# EAGLE design bt_schield (EAGLE 7.2.0)
CNAME: Arduino Bluetooth HC-05 shield; CREVISION: 001; DESIGNER: M.Vagovszky
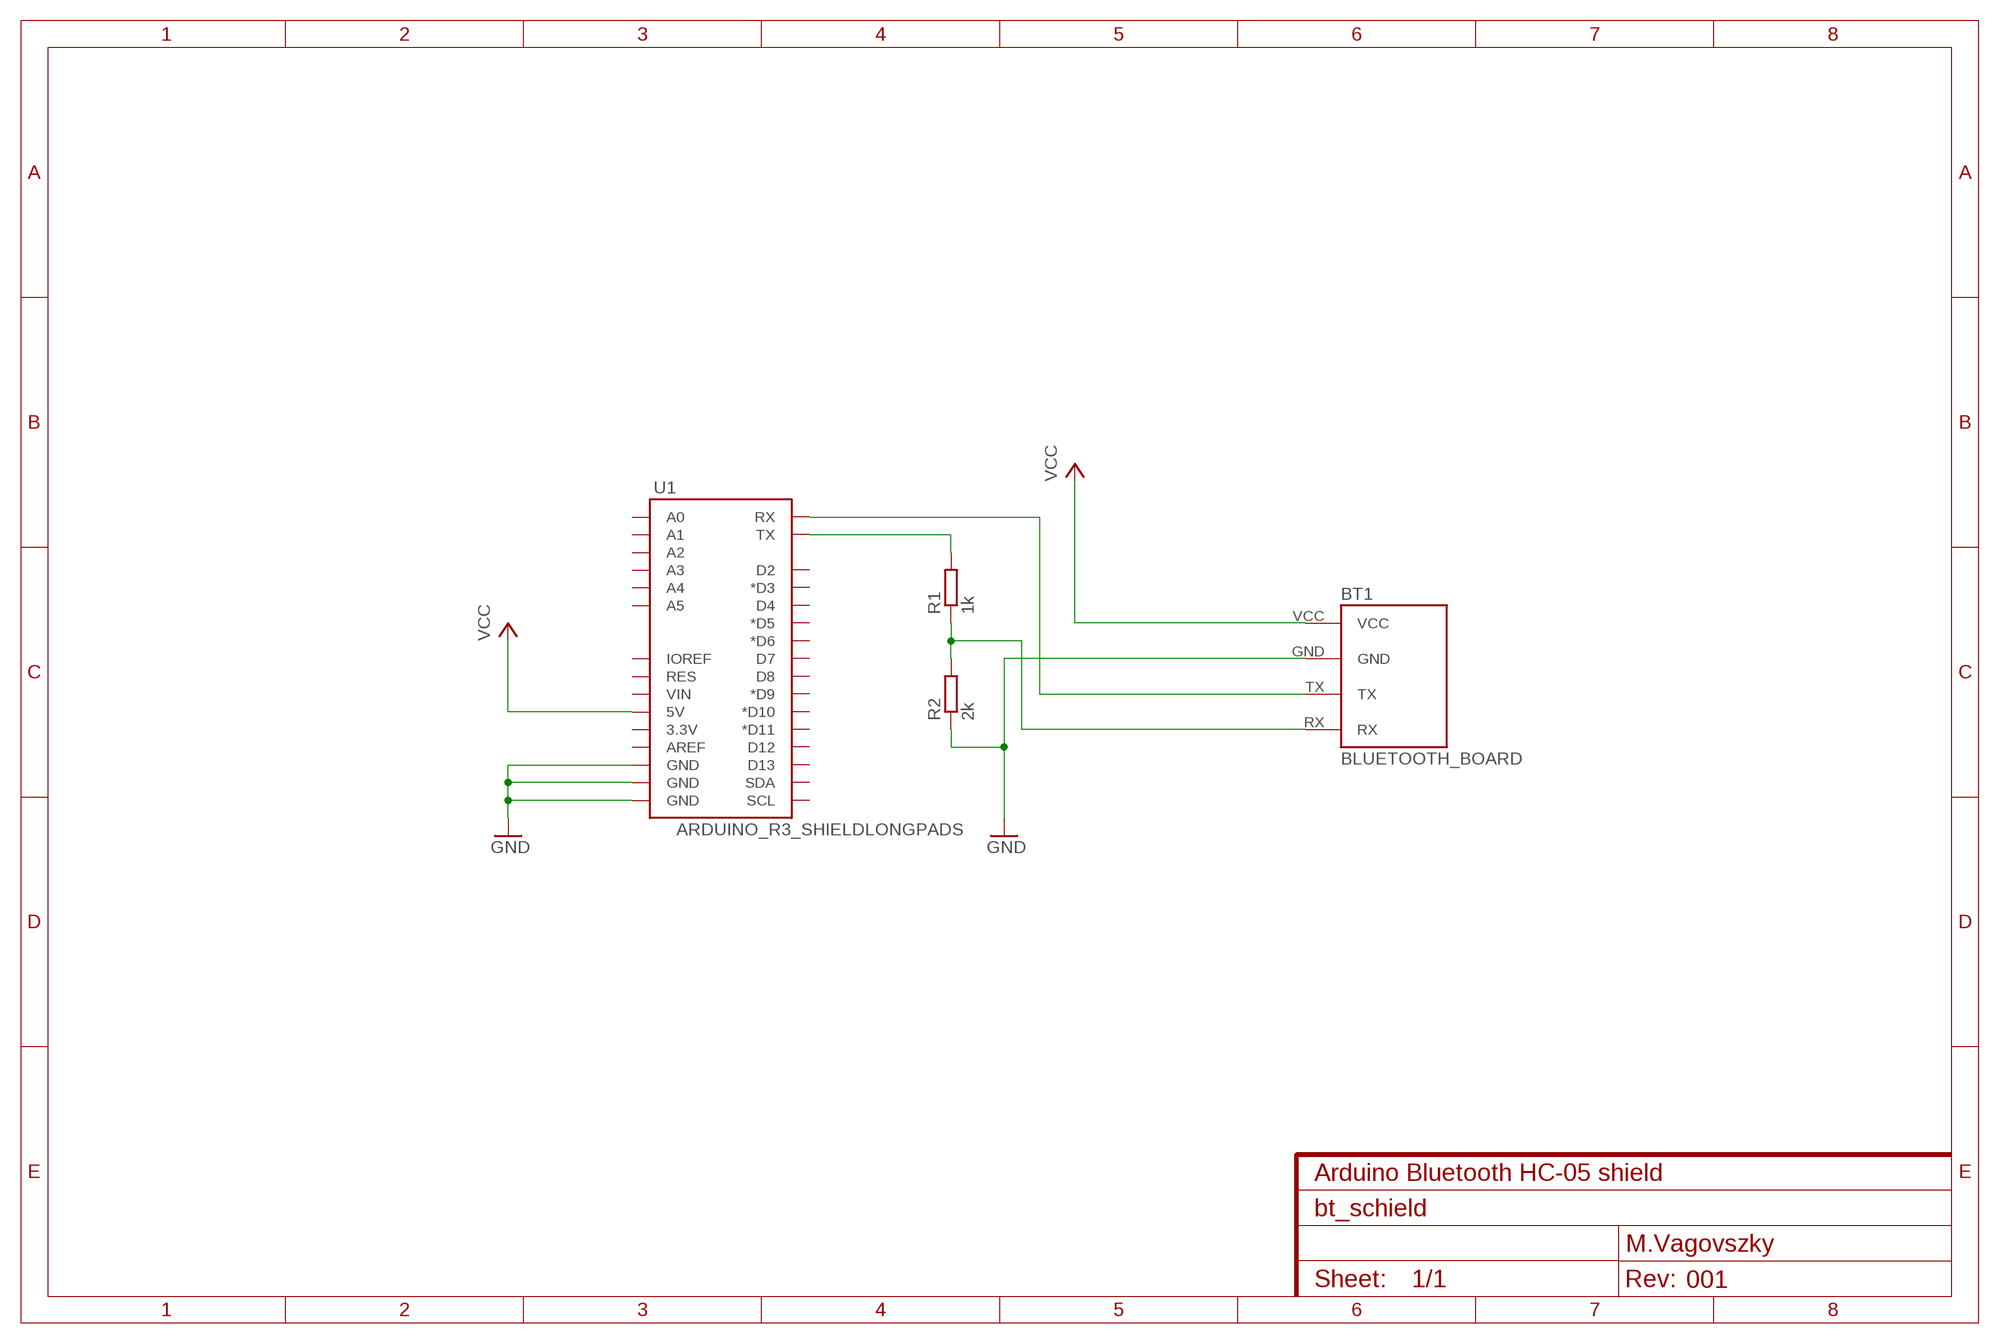
[diagram p0: schematic, sheet 1]

## Parts
BT1  BLUETOOTH_BOARD  [BT_BOARD_FOOTPRINT]
R1  1k  R-EU_0207/12  [0207/12]
R2  2k  R-EU_0207/12  [0207/12]
U1  ARDUINO_R3_SHIELDLONGPADS  [UNO_R3_SHIELD_LONGPADS]

## Nets
GND: BT1.GND R2.1 U1.GND@0(GND) U1.GND@1(GND) U1.GND@2(GND)
N$11: BT1.RX R1.1 R2.2
N$12: BT1.TX U1.RX
N$14: R1.2 U1.TX
VCC: BT1.VCC U1.5V
Unconnected: U1.3.3V U1.A0 U1.A1 U1.A2 U1.A3 U1.A4 U1.A5 U1.AREF U1.D2 U1.D3(*D3) U1.D4 U1.D5(*D5) U1.D6(*D6) U1.D7 U1.D8 U1.D9(*D9) U1.D10(*D10) U1.D11(*D11) U1.D12 U1.D13 U1.IOREF U1.RES U1.SCL U1.SDA U1.VIN

## Library data of the parts
BT1 = HC-05:BLUETOOTH_BOARD: Bluetooth Board V1.05
R1 R2 = my_rcl:R-EU_: RESISTOR, European symbol
U1 = My:ARDUINO_R3_SHIELD: Shield form compatible with the Arduino Uno R3.

## Board
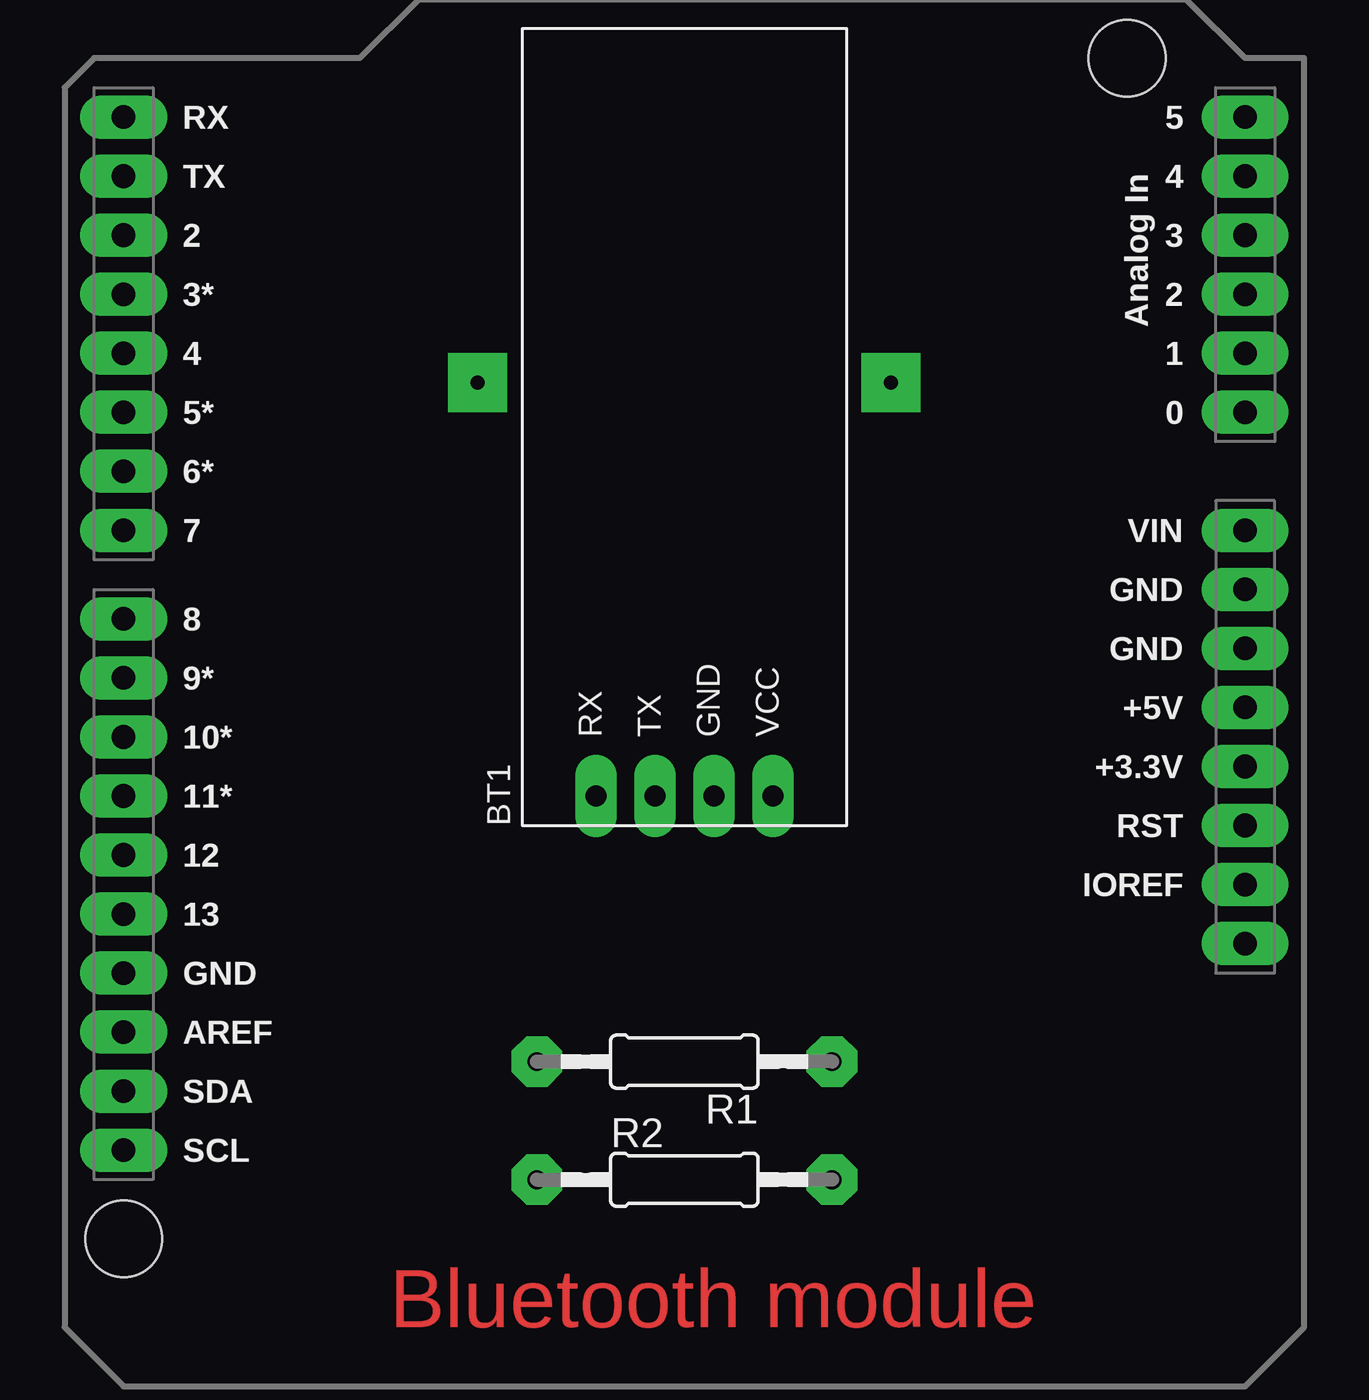
[diagram p1: board, top side]
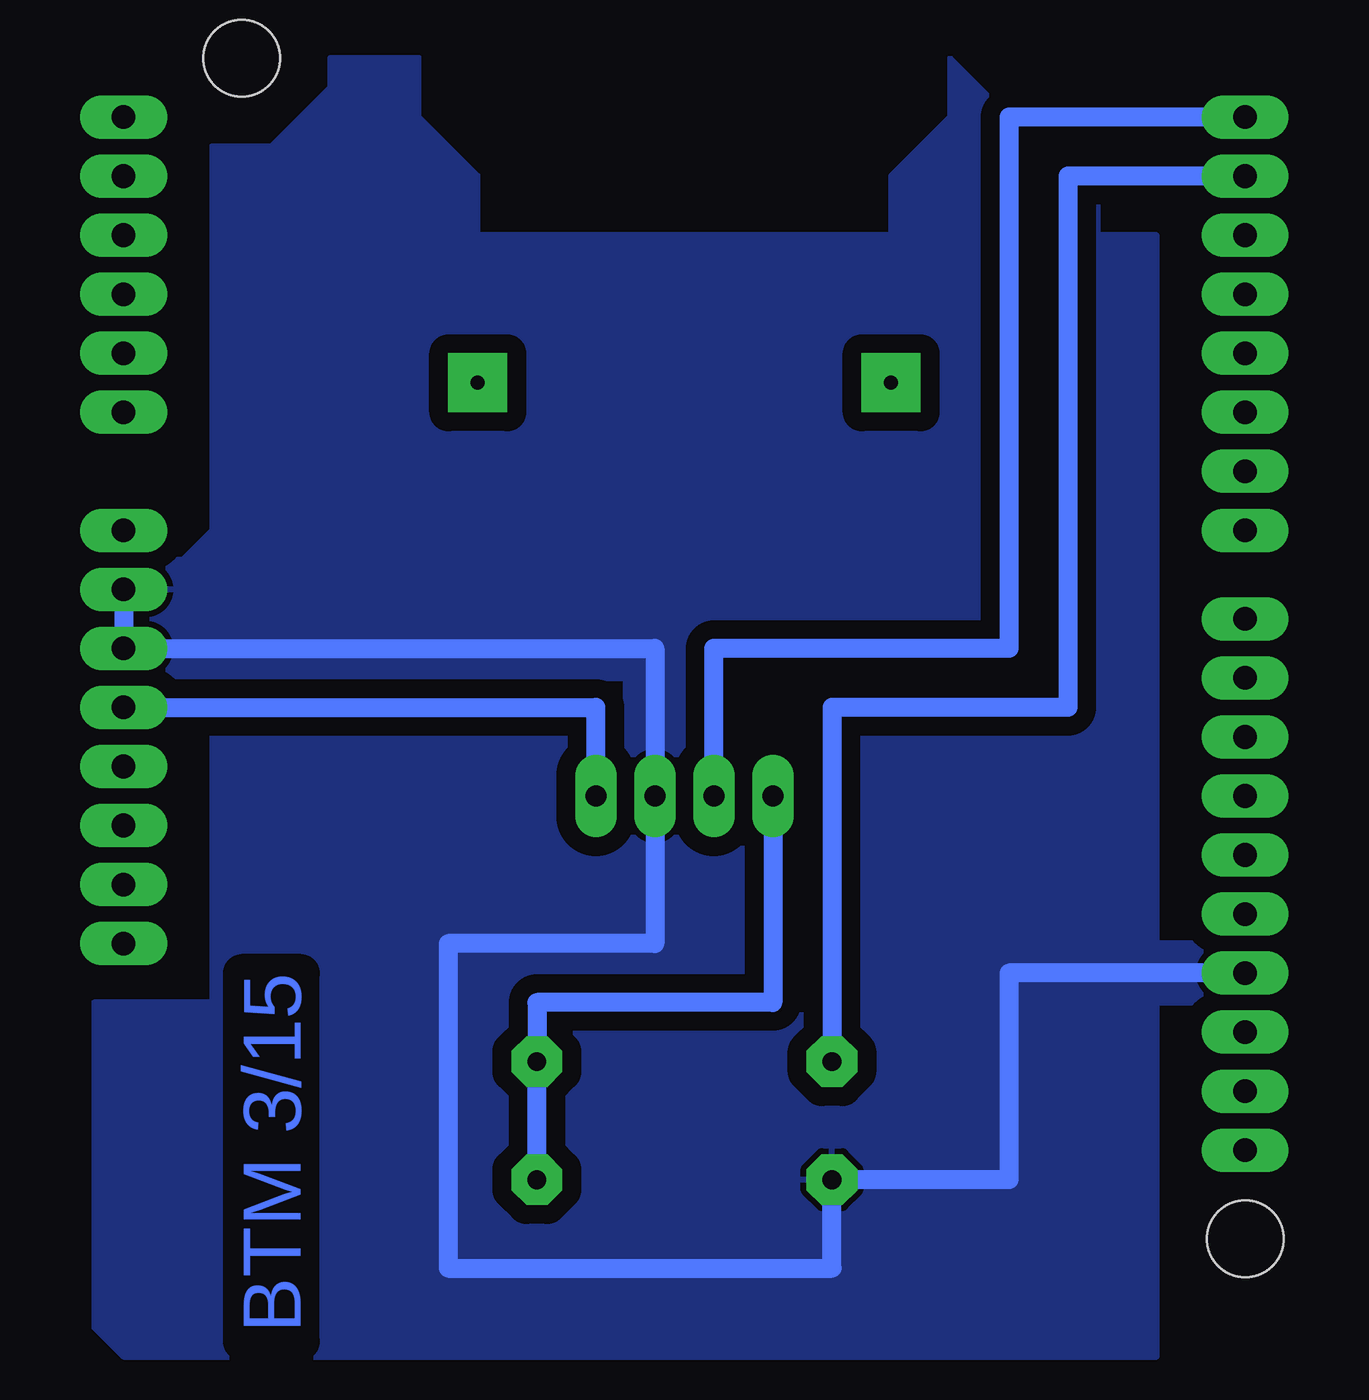
[diagram p2: board, bottom side, seen from below]

No outline drawn. Coordinates in mm, seen from the top.
Copper layers (1*16): Top 0.035mm / dielectric 1.5mm / Bottom 0.035mm
Design rules "default": minimum track width 10mil, minimum drill 24mil, track to track 8mil, track to pad 8mil, pad to pad 8mil, via to via 8mil, smd to smd 8mil, copper to edge 40mil, drill to drill 8mil, minimum pad ring 10mil, minimum via ring 8mil, stop-mask expansion 4mil, vias tented up to drill 0mil, thermal gap 10mil

### Footprints (pad centres in the part's own frame; a part is rotated, then mirrored left to right if it is on the bottom)
BT_BOARD_FOOTPRINT = drill 0.9 pad 1.778 long: GND -16.51,-1.27; RX -16.51,3.81; TX -16.51,1.27; VCC -16.51,-3.81
0207/12 = drill 0.813 pad 2.184 octagon: 1 -6.35,0; 2 6.35,0
UNO_R3_SHIELD_LONGPADS = drill 1.016 pad 1.88 long: 3.3V 50.8,26.67; 5V 50.8,29.21; A0 50.8,41.91; A1 50.8,44.45; A2 50.8,46.99; A3 50.8,49.53; A4 50.8,52.07; A5 50.8,54.61; AREF 2.54,15.24; D2 2.54,49.53; D3 2.54,46.99; D4 2.54,44.45; D5 2.54,41.91; D6 2.54,39.37; D7 2.54,36.83; D8 2.54,33.02; D9 2.54,30.48; D10 2.54,27.94; D11 2.54,25.4; D12 2.54,22.86; D13 2.54,20.32; GND@0 50.8,31.75; GND@1 50.8,34.29; GND@2 2.54,17.78; IOREF 50.8,21.59; NC 50.8,19.05; RES 50.8,24.13; RX 2.54,54.61; SCL 2.54,10.16; SDA 2.54,12.7; TX 2.54,52.07; VIN 50.8,36.83 | hole 3.302: 45.72,57.15; 2.54,6.35

### Placement (x,y rotation side)
BT1  27.94,43.18 90 top
R1  27.94,15.24 180 top
R2  27.94,10.16 0 top
U1  1.27,1.27 0 top

### Tracks (layer width: path | path; a pad name or v marks a point on that pad's centre or on a via)
GND
  Bottom 0.813: U1.GND@2 13.97,19.05 13.97,10.16 R2.1 21.59,6.35 38.1,6.35 38.1,20.32 29.21,20.32 BT1.GND 29.21,33.02 U1.GND@0 U1.GND@1
  pour Bottom (isolate 0.813): 16.51,58.42 16.51,55.88 19.05,53.34 19.05,50.8 36.83,50.8 36.83,53.34 39.37,55.88 39.37,58.42 43.18,58.42 43.18,57.15 45.72,54.61 48.26,54.61 48.26,38.1 49.53,36.83 53.34,36.83 53.34,31.75 30.48,31.75 30.48,25.4 33.02,25.4 33.02,29.21 48.26,29.21 48.26,17.78 53.34,17.78 53.34,3.81 52.07,2.54 7.62,2.54 7.62,17.78 3.81,17.78 3.81,20.32 7.62,20.32 7.62,50.8 10.16,50.8 10.16,52.07
N$1  (via drill 0.6 pad 2.54)
  other vias: 19.05,44.45
N$2  (via drill 0.6 pad 2.54)
  other vias: 36.83,44.45
N$11
  Bottom 0.813: R2.2 R1.1 34.29,17.78 24.13,17.78 BT1.RX
N$12
  Bottom 0.813: U1.RX 13.97,55.88 13.97,33.02 26.67,33.02 BT1.TX
N$14
  Bottom 0.813: U1.TX 11.43,53.34 11.43,30.48 21.59,30.48 R1.2
VCC
  Bottom 0.813: U1.5V 31.75,30.48 BT1.VCC

### Text on the board
Top: Bluetooth module
Bottom: BTM 3/15